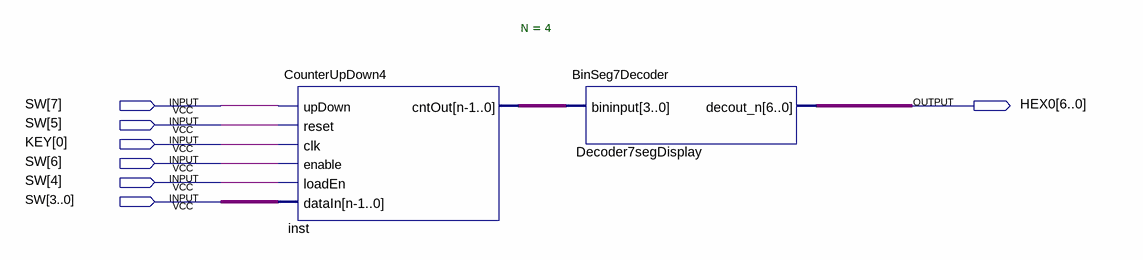
[diagram p0: schematic sheet]
// Quartus schematic Counter4Display_Demo.bdf as structural Verilog: 2 symbols, 7 pins
module Counter4Display_Demo (
  input  [7:0] SW,
  input  [0:0] KEY,
  output [6:0] HEX0
);

  wire [3:0] inst_cntout;

  CounterUpDown4 #(.N(4)) inst (
    .upDown(SW[7]), .reset(SW[5]), .clk(KEY[0]), .enable(SW[6]), .loadEn(SW[4]), .dataIn(SW[3:0]),
    .cntOut(inst_cntout));
  BinSeg7Decoder Decoder7segDisplay (.bininput(inst_cntout), .decout_n(HEX0));
endmodule
